# Altium schematic sheet Avometer v1.0.SchDoc
size A3
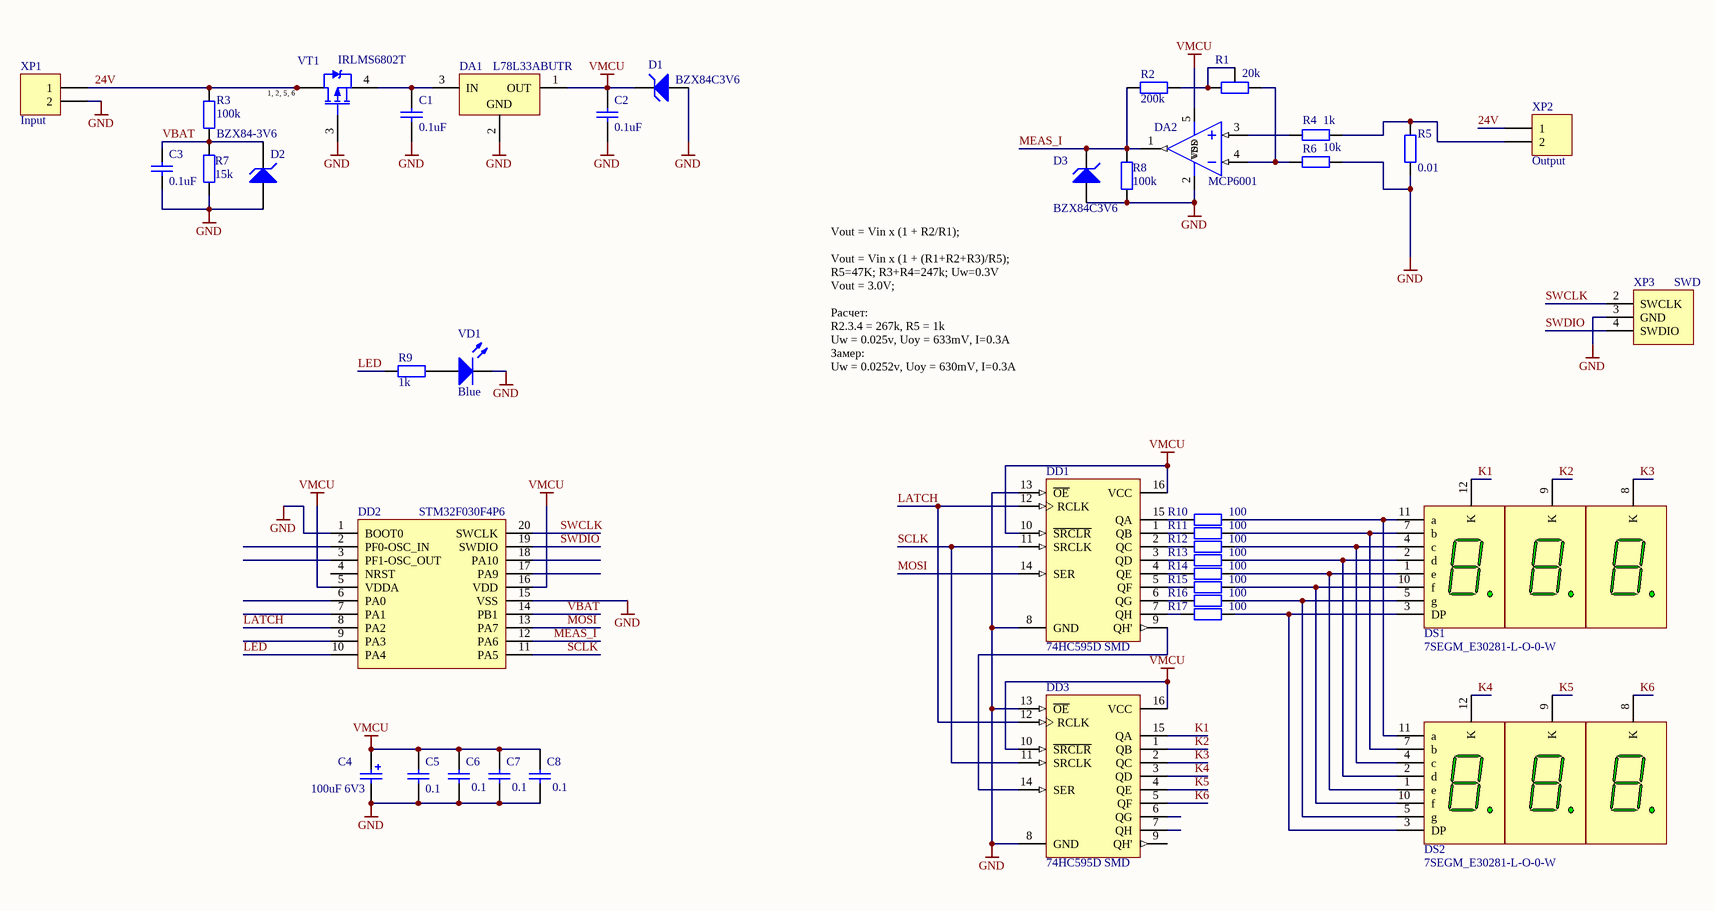
[diagram p0: Avometer v1.0.SchDoc]

## Parts
C1  0.1uF  [CAP 0603_N]
C2  0.1uF  [CAP 0603_N]
C3  0.1uF  [CAP 0603_N]
C4  100uF 6V3  [CAP_TANT_B_TYPE_3528-21]
C5  0.1  [CAP 0603_N]
C6  0.1  [CAP 0603_N]
C7  0.1  [CAP 0603_N]
C8  0.1  [CAP 0603_N]
D1  BZX84C3V6  [SOT-23_L]
D2  BZX84-3V6  [SOT-23_L]
D3  BZX84C3V6  [SOT-23_L]
DA1  L78L33ABUTR  [SOT-89]
DA2  MCP6001  [SOT-23-5_L]
DD1  74HC595D SMD  [SOIC-16_L]
DD2  STM32F030F4P6  [TSSOP-20_N]
DD3  74HC595D SMD  [SOIC-16_L]
DS1  7SEGM_E30281-L-O-0-W  [7SEGM_E30281-L-O-0-W GREEN]
DS2  7SEGM_E30281-L-O-0-W  [7SEGM_E30281-L-O-0-W RED]
R1  20k  [RES VAR 1]
R2  200k  [RES 0603_N]
R3  100k  [RES 0603_N]
R4  1k  [RES 0603_N]
R5  0.01  [RES 2512]
R6  10k  [RES 0603_N]
R7  15k  [RES 0603_N]
R8  100k  [RES 0603_N]
R9  1k  [RES 0603_N]
R10  100  [RES 0603_N]
R11  100  [RES 0603_N]
R12  100  [RES 0603_N]
R13  100  [RES 0603_N]
R14  100  [RES 0603_N]
R15  100  [RES 0603_N]
R16  100  [RES 0603_N]
R17  100  [RES 0603_N]
VD1  Blue  [LED 0603 BLUE]
VT1  IRLMS6802T  [SOT-23-6_L]
XP1  Input  [CON_5.08MM_1X2]
XP2  Output  [CON_5.08MM_1X2]
XP3  SWD  [CON_1.27MM_1X3_SWD]

## Nets
GND: C1.1 C2.1 C3.1 C4.2 C5.1 C6.2 C7.2 C8.2 D1.1(A) D2.1(A) D3.1(A) DA1.2(GND) DA2.2(VSS) DD1.8(GND) DD1.13(~{OE}) DD2.1(BOOT0) DD2.15(VSS) DD3.8(GND) DD3.13(~{OE}) R5.1 R6.1 R7.1 R8.1 VD1.2(K) VT1.3(G) XP1.2 XP3.3(GND)
VMCU: C2.2 C4.1 C5.2 C6.1 C7.1 C8.1 D1.3(K) DA1.1(OUT) DA2.5(VDD) DD1.10(~{SRCLR}) DD1.16(VCC) DD2.5(VDDA) DD2.16(VDD) DD3.10(~{SRCLR}) DD3.16(VCC)
24V: R3.2 VT1.1(D) VT1.2(D) VT1.5(D) VT1.6(D) XP1.1 XP2.1
K1: DD3.15(QA) DS1.12(K)
K2: DD3.1(QB) DS1.9(K)
K3: DD3.2(QC) DS1.8(K)
K4: DD3.3(QD) DS2.12(K)
K5: DD3.4(QE) DS2.9(K)
K6: DD3.5(QF) DS2.8(K)
LATCH: DD1.12(RCLK) DD2.8(PA2) DD3.12(RCLK)
LED: DD2.10(PA4) R9.1
MEAS_I: D3.3(K) DA2.1(VOUT) DD2.12(PA6) R2.2 R8.2
MOSI: DD1.14(SER) DD2.13(PA7)
SCLK: DD1.11(SRCLK) DD2.11(PA5) DD3.11(SRCLK)
SWCLK: DD2.20(SWCLK) XP3.2(SWCLK)
SWDIO: DD2.19(SWDIO) XP3.4(SWDIO)
VBAT: C3.2 D2.3(K) DD2.14(PB1) R3.1 R7.2
NetC1_2: C1.2 DA1.3(IN) VT1.4(S)
NetDA2_3: DA2.3(VIN+) R4.2
NetDA2_4: DA2.4(VIN-) R1.3(B) R6.2
NetDD1_1: DD1.1(QB) R11.1
NetDD1_2: DD1.2(QC) R12.1
NetDD1_3: DD1.3(QD) R13.1
NetDD1_4: DD1.4(QE) R14.1
NetDD1_5: DD1.5(QF) R15.1
NetDD1_6: DD1.6(QG) R16.1
NetDD1_7: DD1.7(QH) R17.1
NetDD1_9: DD1.9(QH') DD3.14(SER)
NetDD1_15: DD1.15(QA) R10.1
NetDS1_1: DS1.1(e) DS2.1(e) R14.2
NetDS1_2: DS1.2(d) DS2.2(d) R13.2
NetDS1_3: DS1.3(DP) DS2.3(DP) R17.2
NetDS1_4: DS1.4(c) DS2.4(c) R12.2
NetDS1_5: DS1.5(g) DS2.5(g) R16.2
NetDS1_7: DS1.7(b) DS2.7(b) R11.2
NetDS1_10: DS1.10(f) DS2.10(f) R15.2
NetDS1_11: DS1.11(a) DS2.11(a) R10.2
NetR1_1: R1.1(A) R1.2(TAP) R2.1
NetR4_1: R4.1 R5.2 XP2.2
NetR9_2: R9.2 VD1.1(A)

Not connected (* = marked no-connect by the designer): DD2 2(PF0-OSC_IN) 3(PF1-OSC_OUT) 4(NRST) 6(PA0) 7(PA1) 9(PA3) 17(PA9) 18(PA10); DD3 6(QG) 7(QH) 9(QH')

## Notes on the sheet
- Vout = Vin x (1 + R2/R1);
  Vout = Vin x (1 + (R1+R2+R3)/R5);
  R5=47K; R3+R4=247k; Uw=0.3V
  Vout = 3.0V;
  Расчет:
  R2.3.4 = 267k, R5 = 1k
  Uw = 0.025v, Uoy = 633mV, I=0.3A
  Замер:
  Uw = 0.0252v, Uoy = 630mV, I=0.3A
- (in symbol IRLMS6802T) 1, 2, 5, 6

## Library data of the parts
C1 C2 C5-C8 = CAP_SMD: Capacitor SMD
C3 = CAP_SMD
C4 = CAP_SMD_TANT: Capacitor SMD Tantalum
D1-D3 = BZX84: Zener Diode; Published: 8-Jun-2000; LatestRevisionDate: 17-Jul-2002; LatestRevisionNote: Re-released for DXP Platform.; PackageReference: DIODE-0.7; Publisher: Altium Limited; PackageDescription: Diode, Thru-Hole; 2 Leads; 0.7 in Pin Spacing
DA1 = L78L33ABUTR: Vin=30V Positive Voltage Regulator; Published: 24-Aug-2001; LatestRevisionDate: 17-Jul-2002; LatestRevisionNote: Re-released for DXP Platform.; DatasheetVersion: Feb-1999; PackageReference: TO92; Publisher: Altium Limited; PackageDescription: TO, Flat Index; 3 In-Line, Axial Leads; Body Dia. 4.8mm; Leads 0.51 x 0.51 mm (max); ComponentLink1Description: Manufacturer Link; ComponentLink1URL: http://www.st.com/
DA2 = MCP6001: 1 MHz, Low-Power Op Amp
DD1 DD3 = 74HC595D SMD: 8-Bit Shift Register with 3-State Output Registers; Published: 8-Jun-2000; LatestRevisionDate: 13-Apr-2006; LatestRevisionNote: IPC-7351 Footprint Added.; DatasheetVersion: May-1997; PackageVersion: Jan-1998; PackageReference: D016; Publisher: Altium Limited; PackageDescription: 16-Pin Small Outline Integrated Circuit 1.27 mm Pitch; Code_IPC: SOIC127P600-16; ComponentLink1Description: Manufacturer Link; ComponentLink1URL: http://www.ti.com/; ComponentLink2Description: Datasheet; ComponentLink2URL: http://www-s.ti.com/sc/ds/sn74hc595.pdf
DD2 = STM32F030F4P6: Cortex-M0 32-bit MCU, 16 KB Flash, 4 KB Internal RAM, 15 I/Os, 20-pin TSSOP, -40 to 85 degC
DS1 DS2 = 7SEGM_E30281-L-O-0-W: 7 mm Black Surface Green 7-Segment Display: CC, RH DP; MinimumIntensity: 860 ucd; Note: IF = 10 mA; Note: Pins 1 and 6 are redundant Cathodes.; Published: 8-Jun-2000; LatestRevisionDate: 17-Dec-2003; LatestRevisionNote: Schematic revised, PCB Footprint replaced.; DatasheetVersion: 19-Feb-2002; PackageVersion: 11-Feb-2002; PackageReference: A; Publisher: Altium Limited; PackageDescription: LED, 7-Segment Display, 7.62 mm, RHD; 10 Leads; Row Space 5.08 mm; Pitch 2.54 mm; Colour: Green; ComponentLink1Description: Manufacturer Link; ComponentLink1URL: http://www.agilent.com/
R1 = RES_SMD_Tap: Tapped Resistor; Sim Note: Enter the Resistance value and the set point into parameter fields.; Set Position: 0.5; Published: 24-Mar-1999; LatestRevisionDate: 17-Jul-2002; LatestRevisionNote: Re-released for DXP Platform.; PackageReference: VR3; Publisher: Altium Limited; PackageDescription: Variable Resistor, Thru-Hole; 3 Leads
R2 R4 R6 R8 R10-R17 = Resistor_SMD
R3 R7 R9 = RES_SMD
R5 = RES_SMD: Resistor
VD1 = LED_SMD_0603: LED 0603; Published: 8-Jun-2000; LatestRevisionDate: 17-Jul-2002; LatestRevisionNote: Re-released for DXP Platform.; PackageVersion: Feb-2002; PackageReference: 3.2X1.6X1.1; Publisher: Altium Limited; PackageDescription: SM LED; 2 Flat Leads
VT1 = IRLMS6802T: P-Channel MOSFET 20V 4.5A; Published: 8-Jun-2000; LatestRevisionDate: 13-Apr-2006; LatestRevisionNote: IPC-7351 Footprint Added.; DatasheetVersion: Aug-1997; PackageVersion: Feb-2001; PackageReference: SO-8; Publisher: Altium Limited; PackageDescription: 8-Pin Plastic Small Outline Integrated Circuit 1.27 mm Pitch; Code_JEDEC: MS-012-AA; Code_IPC: SOIC127P600-8; ComponentLink1Description: Manufacturer Link; ComponentLink1URL: http://www.irf.com/; ComponentLink2Description: Datasheet; ComponentLink2URL: http://www.irf.com/product-info/datasheets/data/irf7416.pdf
XP1 XP2 = CON_5.08mm_1x2: Header, 2-Pin; LatestRevisionDate: 17-Jul-2002; LatestRevisionNote: Re-released for DXP Platform.; Publisher: Altium Limited
XP3 = CON_1.27mm_1x3_SWD: Header, 3-Pin; LatestRevisionDate: 17-Jul-2002; LatestRevisionNote: Re-released for DXP Platform.; Publisher: Altium Limited